# Altium schematic sheet RC Brain Sch.SchDoc
size A4; Author: Alexander Riex; DrawnBy: Alexander Riex; Engineer: Alexander Riex
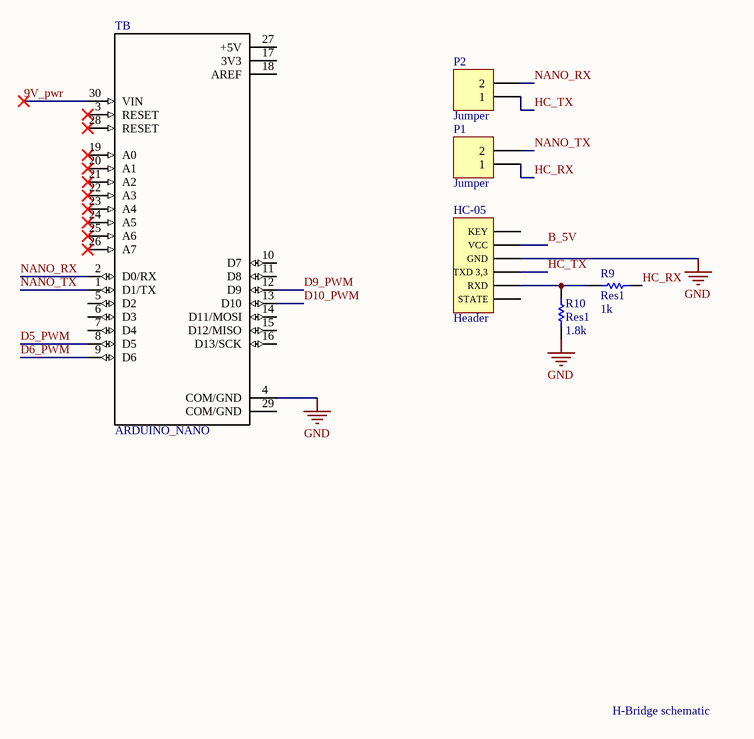
[diagram p0: RC Brain Sch.SchDoc]

## Parts
HC-05  Header  [HDR1X6]
P1  Jumper  [HDR1X2]
P2  Jumper  [HDR1X2]
R9  Res1  value 1k  [6-0805_N]
R10  Res1  value 1.8k  [6-0805_N]
TB  ARDUINO_NANO  [*SHIELD_ARDUINO_NANO]

## Nets
GND: HC-05.3(GND) R10.1 TB.4(COM/GND)
9V_pwr: TB.30(VIN)
B_5V: HC-05.2(VCC)
D5_PWM: TB.8(D5)
D6_PWM: TB.9(D6)
D9_PWM: TB.12(D9)
D10_PWM: TB.13(D10)
HC_RX: P1.1 R9.2
HC_TX: HC-05.4(TXD_3,3) P2.1
NANO_RX: P2.2 TB.2(D0/RX)
NANO_TX: P1.2 TB.1(D1/TX)
NetHC-05_5: HC-05.5(RXD) R9.1 R10.2

Not connected (* = marked no-connect by the designer): HC-05 1(KEY) 6(STATE); TB 3(RESET)* 5(D2) 6(D3) 7(D4) 10(D7) 11(D8) 14(D11/MOSI) 15(D12/MISO) 16(D13/SCK) 17(3V3) 18(AREF) 19(A0)* 20(A1)* 21(A2)* 22(A3)* 23(A4)* 24(A5)* 25(A6)* 26(A7)* 27(+5V) 28(RESET)* 29(COM/GND)

## Notes on the sheet
- H-Bridge schematic

## Library data of the parts
HC-05 = Header 6: Header, 6-Pin; LatestRevisionDate: 17-Jul-2002; LatestRevisionNote: Re-released for DXP Platform.; Publisher: Altium Limited
P1 P2 = Header 2: Header, 2-Pin; LatestRevisionDate: 17-Jul-2002; LatestRevisionNote: Re-released for DXP Platform.; Publisher: Altium Limited
R9 R10 = Res1: Resistor; Published: 8-Jun-2000; LatestRevisionDate: 17-Jul-2002; LatestRevisionNote: Re-released for DXP Platform.; PackageReference: AXIAL-0.3; Publisher: Altium Limited; PackageDescription: Axial Device, Thru-Hole; 2 Leads; 0.3 in Pin Spacing
TB = ARDUINO_NANO: ATmega328 Arduino Nano AVRÂ® ATmega AVR MCU 8-Bit Embedded Evaluation Board; MF: Arduino; SnapEDA_Link: https://www.snapeda.com/parts/ARDUINO%20NANO/Arduino/view-part/1128261/?ref=snap; Price: None; Availability: Unavailable; MP: ARDUINO NANO; Package: None; Value: *